# Altium project Speaker Module Rev 2.PrjPcb
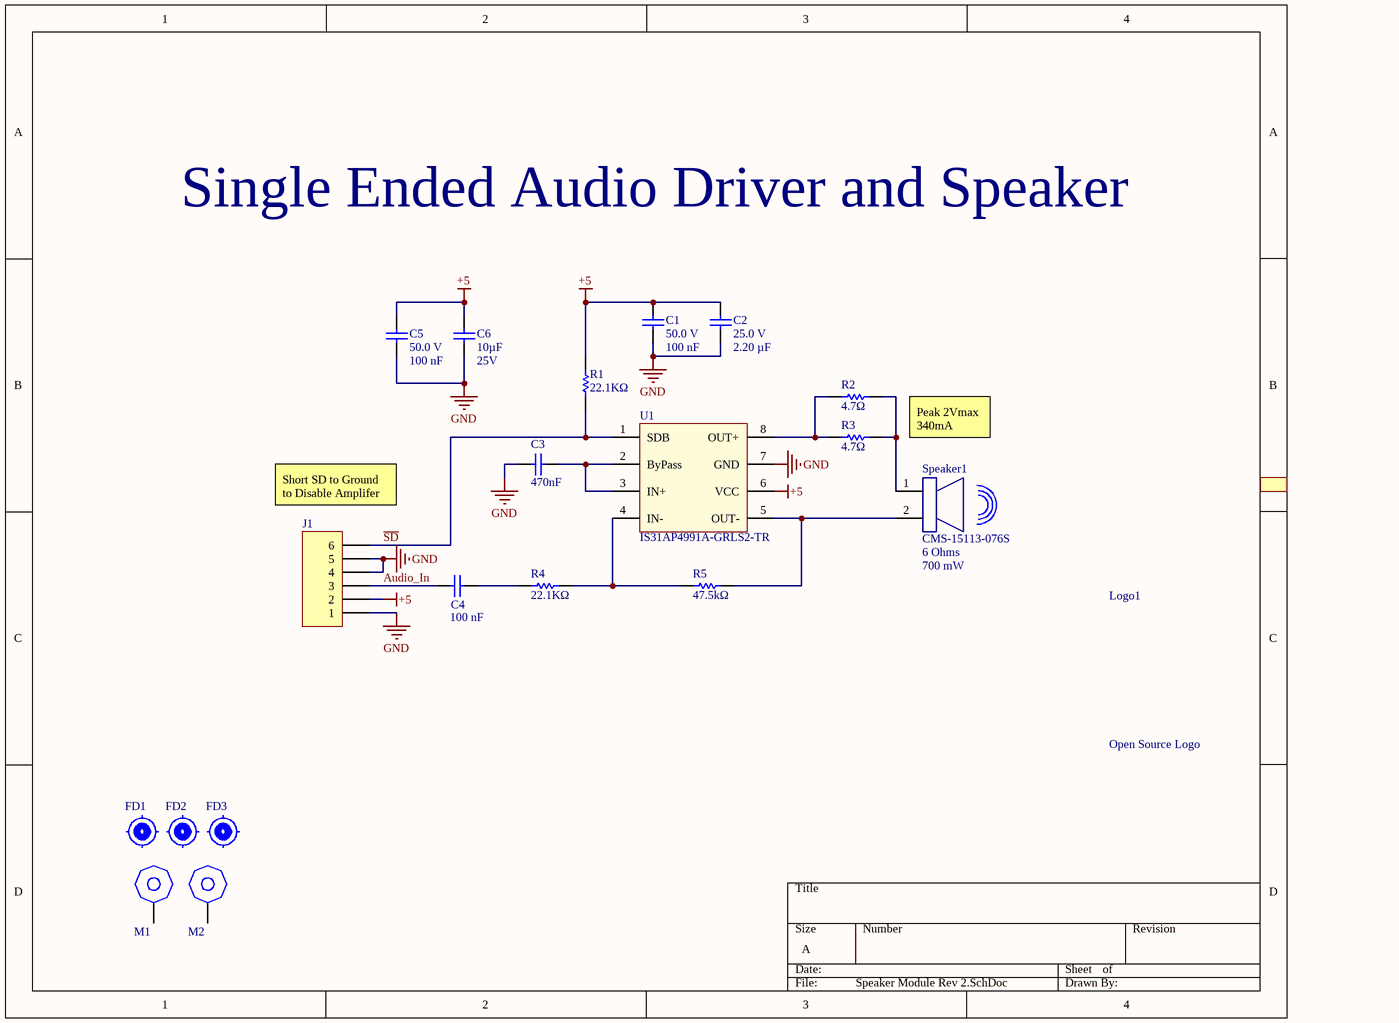
[diagram p0: Speaker Module Rev 2.SchDoc]
1 sheet, 20 parts. Net scope: global (net labels, ports and power ports of the same name join across sheets).

## Sheet Speaker Module Rev 2.SchDoc
size A

### Parts
C1  Voltage Rating (DC): 50.0 V  Capacitance: 100 nF  [Cap,0805]  (hidden comment: 08055C104JAT2A)
C2  Voltage Rating (DC): 25.0 V  Capacitance: 2.20 µF  [CAP, 0805, HD]  (hidden comment: AVX 08053C225KAT2A)
C3  Capacitance: 470nF  [Cap,0805]  (hidden comment: CGA4J2X7R1E474K125AA)
C4  Capacitance: 100 nF  [Cap,0805]  (hidden comment: 08055C104JAT2A)
C5  Voltage Rating (DC): 50.0 V  Capacitance: 100 nF  [Cap,0805]  (hidden comment: 08055C104JAT2A)
C6  Capacitance: 10µF  Voltage - Rated: 25V  [Cap, 1206]  (hidden comment: C3216X7R1E106K160AB)
FD1  Mech,FIDU-ROUND  [FIDU-ROUND]  (value not drawn)
FD2  Mech,FIDU-ROUND  [FIDU-ROUND]  (value not drawn)
FD3  Mech,FIDU-ROUND  [FIDU-ROUND]  (value not drawn)
J1  Header, through hole,vertical, 6pin,1 Row,0.1", M20-9991245  [Header, 6 pin, 0.1" Spaceing - RA]  (value not drawn)
Logo1  Open Source Logo  [Symbol,Open Source]
M1  M3 hex Standoff  [Standoff,Hex,M3,8mm]  (value not drawn)
M2  M3 hex Standoff  [Standoff,Hex,M3,8mm]  (value not drawn)
R1  Resistance: 22.1KΩ  [res, 0805, HD]  (hidden comment: RC0805FR-0722K1L)
R2  4.7Ω  [Res,1206]
R3  4.7Ω  [Res,1206]
R4  Resistance: 22.1KΩ  [res, 0805, HD]  (hidden comment: RC0805FR-0722K1L)
R5  Resistance: 47.5kΩ  [res, 0805, HD]  (hidden comment: RK73H2ATTD4752F)
Speaker1  CMS-15113-076S  Impedance: 6 Ohms  Power - Rated: 700 mW  [Speaker,SMD,CMS-15113-076S]
U1  IS31AP4991A-GRLS2-TR  [SOIC-8]

### Nets
+5: C1.1 C2.2 C5.1 C6.2 J1.2 R1.1 U1.6(VCC)
GND: C1.2 C2.1 C3.2 C5.2 C6.1 J1.1 J1.4 J1.5 U1.7(GND)
Audio_In: C4.1 J1.3
~{SD}: J1.6 R1.2 U1.1(SDB)
NetC3_1: C3.1 U1.2(ByPass) U1.3(IN+)
NetC4_2: C4.2 R4.2
NetR2_1: R2.1 R3.1 Speaker1.1
NetR2_2: R2.2 R3.2 U1.8(OUT+)
NetR4_1: R4.1 R5.2 U1.4(IN-)
NetR5_1: R5.1 Speaker1.2 U1.5(OUT-)

Not connected (* = marked no-connect by the designer): M1 0; M2 0

### Notes on the sheet
- Single Ended Audio Driver and Speaker
- Peak 2Vmax
  340mA
- (near J1) Short SD to Ground to Disable Amplifer

### Library data of the parts
C1 C5 = Cap,0805,100nf,50V,5%,08055C104JAT2A: Capacitor; Ceramic; Cap 0.1 uF; Tol 5%; Vol-Rtg 50 VDC; SMT; 0805; X7R; Tape & Reel; Lead-Free Status: Lead Free; Case/Package (SI): 2012; Insulation Resistance: 100 GΩ; Detailed Description: 0.1µF ±5% 50V Ceramic Capacitor X7R 0805 (2012 Metric); Mounting Style: Surface Mount; Packaging: Tape & Reel (TR), Cut Tape (CT); RoHS: Compliant; Size-Width: 1.24 mm; Case/Package: 0805; Number of Pins: 2; digikey url: http://www.digikey.ca/product-detail/en/avx-corporation/08055C104JAT2A/478-3352-1-ND/930144; REACH SVHC Compliance: No SVHC; Dielectric Characteristic: X7R; Capacitance Tolerance: ±5%; Size-Length: 2.01 mm; Size-Height: 710 µm; Size-Thickness: 940 µm; Manufacturer Part Number: 08055C104JAT2A; Octopart URL: http://octopart.com/08055c104jat2a-avx-55388010; Operating Temperature: -55°C ~ 125°C; Supplier 1: Digi-Key; Supplier Part Number 1: 478-3352-1-ND
C2 = Cap,0805,2.2uF,±10%,25V,08053C225KAT2A: 0805 2.2 uF 25 V ±10 % Tolerance X7R SMT Multilayer Ceramic Capacitor; Lead-Free Status: Lead Free; Case/Package (SI): 2012; Capacitance Tolerance: ±10%; REACH SVHC Compliance: No SVHC; Manufacturer Part Number: 08053C225KAT2A; Octopart URL: http://octopart.com/08053c225kat2a-avx-46506595; Case/Package: 0805; Mounting Style: Surface Mount; Dielectric Characteristic: X7R; RoHS: Compliant; Packaging: Cut Tape (CT), Tape & Reel (TR); Number of Pins: 2; Supplier 1: Digi-Key; Supplier Part Number 1: 478-5719-1-ND; Supplier 2: LCSC; Supplier Part Number 2: C167401
C3 = Cap,0805,470nf,25V,10%,CGA4J2X7R1E474K125AA: 0.47µF ±10% 25V Ceramic Capacitor X7R 0805 (2012 Metric); Manufacturer: TDK Corporation; Lead-Free Status: Lead Free; Case/Package (SI): 2012; Mounting Style: Surface Mount; Packaging: Tape & Reel (TR), Cut Tape (CT); RoHS: Compliant; Size-Width: 1.24 mm; Case/Package: 0805; Number of Pins: 2; REACH SVHC Compliance: No SVHC; Dielectric Characteristic: X7R; Capacitance Tolerance: ±10%; Size-Length: 2.01 mm; Size-Height: 710 µm; Size-Thickness: 940 µm; mfg P/N: CGA4J2X7R1E474K125AA; Ratings: AEC-Q200; Supplier 1: Digi-Key; Supplier Part Number 1: 445-5685-1-ND; Voltage Rating (DC): 25V
C4 = Cap,0805,100nf,50V,5%,08055C104JAT2A: Capacitor; Ceramic; Cap 0.1 uF; Tol 5%; Vol-Rtg 50 VDC; SMT; 0805; X7R; Tape & Reel; Lead-Free Status: Lead Free; Case/Package (SI): 2012; Insulation Resistance: 100 GΩ; Detailed Description: 0.1µF ±5% 50V Ceramic Capacitor X7R 0805 (2012 Metric); Voltage Rating (DC): 50.0 V; Mounting Style: Surface Mount; Packaging: Tape & Reel (TR), Cut Tape (CT); RoHS: Compliant; Size-Width: 1.24 mm; Case/Package: 0805; Number of Pins: 2; digikey url: http://www.digikey.ca/product-detail/en/avx-corporation/08055C104JAT2A/478-3352-1-ND/930144; REACH SVHC Compliance: No SVHC; Dielectric Characteristic: X7R; Capacitance Tolerance: ±5%; Size-Length: 2.01 mm; Size-Height: 710 µm; Size-Thickness: 940 µm; Manufacturer Part Number: 08055C104JAT2A; Octopart URL: http://octopart.com/08055c104jat2a-avx-55388010; Operating Temperature: -55°C ~ 125°C; Supplier 1: Digi-Key; Supplier Part Number 1: 478-3352-1-ND
C6 = CAP,1206,10uF,25V,C3216X7R1E106K160AB: 10µF ±10% 25V Ceramic Capacitor X7R 1206 (3216 Metric); Manufacturer: TDK Corporation; Features Low: ESL; mfg P/N: C3216X7R1E106K160AB; Tolerance: ±10%; Temperature Coefficient: X7R; Operating Temperature: -55°C ~ 125°C; Applications: General Purpose; Mounting Type: Surface Mount, MLCC; Package / Case: 1206 (3216 Metric); Size / Dimension: 0.126" L x 0.063" W (3.20mm x 1.60mm); Thickness (Max): 0.075" (1.90mm); Supplier 1: Digi-Key; Supplier Part Number 1: 445-7705-1-ND
FD1-FD3 = Mech,FIDU-ROUND: ROUND FIDUCIAL
J1 = Header, through hole,vertical, 6pin,1 Row,0.1", M20-9991245: 2.54mm (0.1") Pitch SIL Vertical PC Tail Pin Header, 6.1mm mating pin height, gold (hi-temp mould), 6 contacts; Manufacturer Part Number: M20-9990645; Number of Contacts: 6; Gender: Male; Number of Mating Cycles: 300; Insulation Resistance: 10.0 GΩ; Voltage Rating (AC): 750 V; Contact Resistance: 15.0 mΩ; Current Rating: 3.00 A; REACH SVHC Compliance: No SVHC; Insulation Material: Polyester; Contact Material: Phosphor Bronze; RoHS: Compliant; Mounting Style: Through Hole, Vertical; Pin Pitch: 2.54 mm; Supplier 1: Digi-Key
Logo1 = Symbol,Open Source: Open Source Silk Screen Logo
M1 M2 = Mech,Standoff, M3, Hex: HEX STANDOFF M3,generic; Supplier 1: Digi-Key; Supplier Part Number 1: 36-24314-ND
R1 R4 = Res,0805,22.1K,1%,100ppm,RC0805FR-0722K1L: 22.1 kOhms ±1% 0.125W, 1/8W Chip Resistor 0805 (2012 Metric) Moisture Resistant Thick Film; Case/Package (SI): 2012; Temperature Coefficient: 100.0 ppm/°C; Voltage Rating (DC): 150.0 V; Case/Package: 0805; Mounting Style: Surface Mount; Number of Pins: 2; Power Rating: 0.125 W; Resistance Tolerance: ±1%; Size-Height: 0.00045 m; Size-Length: 0.002 m; Size-Width: 0.00125 m; Features: Moisture Resistant; Operating Temperature: -55°C ~ 155°C; Supplier 1: Digi-Key; Supplier Part Number 1: 311-22.1KCRCT-ND
R2 R3 = Res,1206,Generic
R5 = Res,0805,47.5KΩ,1%,100ppm,RK73H2ATTD4752F: 47.5 kOhms ±1% 0.25W, 1/4W Chip Resistor 0805 (2012 Metric) Automotive AEC-Q200, Moisture Resistant Thick Film; Manufacturer: KOA Speer Electronics, Inc.; Temperature Coefficient: ±100ppm/°C; Detailed Description: 47.5 kOhms ±1% 0.25W, 1/4W Chip Resistor 0805 (2012 Metric) Automotive AEC-Q200, Moisture Resistant Thick Film; mfg P/N: RK73H2ATTD4752F; Power (Watts): 0.25W, 1/4W; Composition: Thick Film; Features: Automotive AEC-Q200, Moisture Resistant; Operating Temperature: -55°C ~ 155°C; Package / Case 0805: (2012 Metric); Supplier Device Package: 0805; Size / Dimension: 0.079" L x 0.049" W (2.00mm x 1.25mm); Height - Seated (Max): 0.024" (0.60mm); Number of Terminations: 2; Supplier 1: Digi-Key; Supplier Part Number 1: 2019-RK73H2ATTD4752FCT-ND; Tolerance: ±1%
Speaker1 = Speaker,SMD,6Ω,700mW,Magnetic,100 Hz ~ 20 kHz,CMS-15113-076S: 6 Ohms General Purpose Speaker 700 mW 100 Hz ~ 20 kHz Top Rectangular; Manufacturer: CUI Devices; Frequency - Self Resonant: 600Hz; Efficiency - dBA: 92.00; Efficiency - Testing: 700mW/100mm; Efficiency - Type: Sound Pressure Level (SPL); Power - Max: 1 W; Material - Cone: Polyester, Polyethylene Terephthalate (PET); Material - Magnet: Nd-Fe-B; mfg P/N: CMS-15113-076S; Category: Audio Products  Speakers; Series: CMS; Part Status: Active; Technology: Magnetic; Type: General Purpose; Frequency Range: 100 Hz ~ 20 kHz; Port Location: Top; Shape: Rectangular; Termination: Spring Type; Size / Dimension: 0.591" L x 0.433" W (15.00mm x 11.00mm); Height - Seated (Max): 0.118" (3.00mm); Base Product Number: CMS-151
U1 = IC,PowerAmp,ClassAB,1.15W x 1 @ 8Ohm,2.7V ~ 5.5V,IS31AP4991: IC AMP CLASS AB MONO 1.15W 8SOIC; Mfr: Lumissil Microsystems; Detailed Description: Amplifier IC 1-Channel (Mono) Class AB 8-SOIC; Output Type: 1-Channel (Mono); mfg P/N: IS31AP4991A-GRLS2-TR; Category: Integrated Circuits (ICs)  Linear - Amplifiers - Audio; Part Status: Active; Type  Class: AB; Max Output Power x Channels @ Load: 1.15W x 1 @ 8Ohm; Voltage - Supply: 2.7V ~ 5.5V; Features: Depop, Standby; Mounting Type: Surface Mount; Operating Temperature: -40°C ~ 85°C (TA); Supplier Device Package: 8-SOIC; Package / Case: 8-SOIC (0.154", 3.90mm Width); Base Product Number: IS31AP4991; Supplier 1: Mouser; Supplier Part Number 1: 870-I31AP4991AGRLS2T; Supplier 2: Digi-Key; Supplier Part Number 2: 706-1428-1-ND